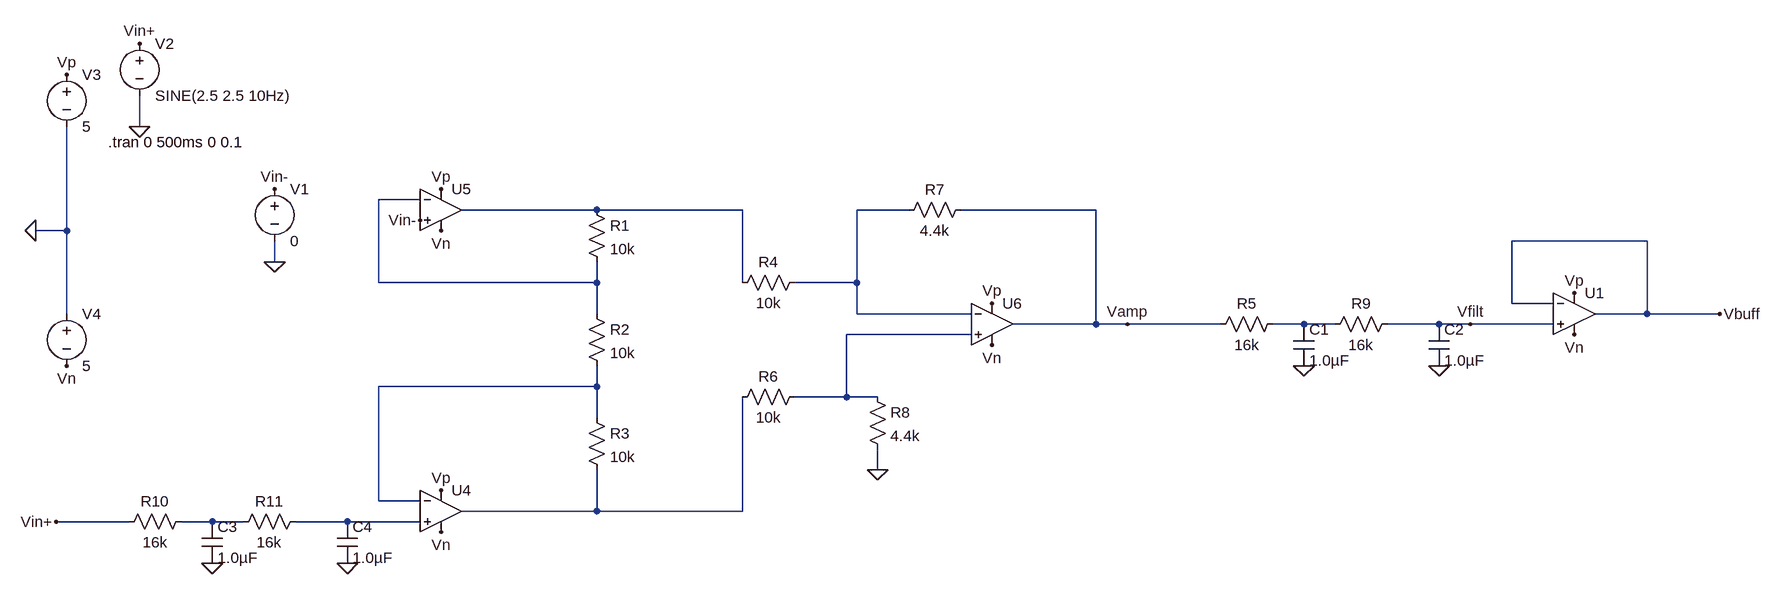
[diagram p0: schematic 3_OP_AMP_Gain_132(V2).asc]
3_OP_AMP_Gain_132(V2).asc, the LTspice schematic file:
Version 4
SHEET 1 2064 788
WIRE -448 -32 -448 -80
WIRE -16 80 -80 80
WIRE 256 96 48 96
WIRE 480 96 256 96
WIRE 736 96 656 96
WIRE 1024 96 816 96
WIRE -560 128 -560 -32
WIRE -560 128 -608 128
WIRE 1872 144 1664 144
WIRE -240 176 -240 144
WIRE -80 208 -80 80
WIRE 256 208 256 176
WIRE 256 208 -80 208
WIRE 480 208 480 96
WIRE 656 208 656 96
WIRE 656 208 560 208
WIRE 1664 240 1664 144
WIRE 1728 240 1664 240
WIRE -560 256 -560 128
WIRE 256 256 256 208
WIRE 656 256 656 208
WIRE 832 256 656 256
WIRE 1872 256 1872 144
WIRE 1872 256 1792 256
WIRE 1984 256 1872 256
WIRE 1024 272 1024 96
WIRE 1024 272 896 272
WIRE 1072 272 1024 272
WIRE 1216 272 1072 272
WIRE 1344 272 1296 272
WIRE 1392 272 1344 272
WIRE 1552 272 1472 272
WIRE 1600 272 1552 272
WIRE 1728 272 1600 272
WIRE 832 288 640 288
WIRE 256 368 256 336
WIRE 256 368 -80 368
WIRE 640 384 640 288
WIRE 640 384 560 384
WIRE 688 384 640 384
WIRE 256 416 256 368
WIRE 688 496 688 464
WIRE -80 544 -80 368
WIRE -16 544 -80 544
WIRE 256 560 256 496
WIRE 256 560 48 560
WIRE 480 560 480 384
WIRE 480 560 256 560
WIRE -464 576 -576 576
WIRE -336 576 -384 576
WIRE -288 576 -336 576
WIRE -128 576 -208 576
WIRE -16 576 -128 576
FLAG -240 176 0
FLAG -448 -32 0
FLAG 688 496 0
FLAG -608 128 0
FLAG -560 -112 Vp
FLAG 864 240 Vp
FLAG 16 64 Vp
FLAG 16 528 Vp
FLAG -560 336 Vn
FLAG 864 304 Vn
FLAG 16 592 Vn
FLAG 16 128 Vn
FLAG -240 64 Vin-
FLAG -16 112 Vin-
FLAG -448 -160 Vin+
FLAG -576 576 Vin+
FLAG 1072 272 Vamp
FLAG 1600 272 Vfilt
FLAG 1344 336 0
FLAG 1552 336 0
FLAG -336 640 0
FLAG -128 640 0
FLAG 1760 224 Vp
FLAG 1760 288 Vn
FLAG 1984 256 Vbuff
SYMBOL res 240 80 R0
SYMATTR InstName R1
SYMATTR Value 10k
SYMBOL res 240 240 R0
SYMATTR InstName R2
SYMATTR Value 10k
SYMBOL res 240 400 R0
SYMATTR InstName R3
SYMATTR Value 10k
SYMBOL res 576 192 R90
WINDOW 0 0 56 VBottom 2
WINDOW 3 32 56 VTop 2
SYMATTR InstName R4
SYMATTR Value 10k
SYMBOL res 576 368 R90
WINDOW 0 0 56 VBottom 2
WINDOW 3 32 56 VTop 2
SYMATTR InstName R6
SYMATTR Value 10k
SYMBOL res 832 80 R90
WINDOW 0 0 56 VBottom 2
WINDOW 3 32 56 VTop 2
SYMATTR InstName R7
SYMATTR Value 4.4k
SYMBOL res 672 368 R0
SYMATTR InstName R8
SYMATTR Value 4.4k
SYMBOL voltage -240 48 R0
WINDOW 123 0 0 Left 0
WINDOW 39 0 0 Left 0
SYMATTR InstName V1
SYMATTR Value 0
SYMBOL voltage -448 -176 R0
WINDOW 123 0 0 Left 0
WINDOW 39 0 0 Left 0
SYMATTR InstName V2
SYMATTR Value SINE(2.5 2.5 10Hz)
SYMBOL voltage -560 -128 R0
SYMATTR InstName V3
SYMATTR Value 5
SYMBOL voltage -560 240 R0
SYMATTR InstName V4
SYMATTR Value 5
SYMBOL res 1312 256 R90
WINDOW 0 0 56 VBottom 2
WINDOW 3 32 56 VTop 2
SYMATTR InstName R5
SYMATTR Value 16k
SYMBOL res 1488 256 R90
WINDOW 0 0 56 VBottom 2
WINDOW 3 32 56 VTop 2
SYMATTR InstName R9
SYMATTR Value 16k
SYMBOL cap 1328 272 R0
SYMATTR InstName C1
SYMATTR Value 1.0µF
SYMBOL cap 1536 272 R0
SYMATTR InstName C2
SYMATTR Value 1.0µF
SYMBOL OpAmps\\UniversalOpAmp2 16 560 R0
SYMATTR InstName U4
SYMBOL OpAmps\\UniversalOpAmp2 16 96 R0
SYMATTR InstName U5
SYMBOL OpAmps\\UniversalOpAmp2 864 272 R0
SYMATTR InstName U6
SYMBOL res -368 560 R90
WINDOW 0 0 56 VBottom 2
WINDOW 3 32 56 VTop 2
SYMATTR InstName R10
SYMATTR Value 16k
SYMBOL res -192 560 R90
WINDOW 0 0 56 VBottom 2
WINDOW 3 32 56 VTop 2
SYMATTR InstName R11
SYMATTR Value 16k
SYMBOL cap -352 576 R0
SYMATTR InstName C3
SYMATTR Value 1.0µF
SYMBOL cap -144 576 R0
SYMATTR InstName C4
SYMATTR Value 1.0µF
SYMBOL OpAmps\\UniversalOpAmp2 1760 256 R0
SYMATTR InstName U1
TEXT -496 -8 Left 2 !.tran 0 500ms 0 0.1

The netlist it stands for:
* 3_OP_AMP_Gain_132(V2).asc
R1 N002 N001 10k
R2 N001 N006 10k
R3 N006 N007 10k
R4 N003 N002 10k
R6 N005 N007 10k
R7 Vamp N003 4.4k
R8 N005 0 4.4k
V1 Vin- 0 0
V2 Vin+ 0 SINE(2.5 2.5 10Hz)
V3 Vp 0 5
V4 0 Vn 5
R5 N004 Vamp 16k
R9 Vfilt N004 16k
C1 N004 0 1.0µF
C2 Vfilt 0 1.0µF
XU4 N009 N006 Vp Vn N007 level2 Avol=1Meg GBW=10Meg Slew=10Meg Ilimit=25m Rail=0 Vos=0 En=0 Enk=0 In=0 Ink=0 Rin=500Meg  ; pins In+ In- V+ V- OUT
XU5 Vin- N001 Vp Vn N002 level2 Avol=1Meg GBW=10Meg Slew=10Meg Ilimit=25m Rail=0 Vos=0 En=0 Enk=0 In=0 Ink=0 Rin=500Meg  ; pins In+ In- V+ V- OUT
XU6 N005 N003 Vp Vn Vamp level2 Avol=1Meg GBW=10Meg Slew=10Meg Ilimit=25m Rail=0 Vos=0 En=0 Enk=0 In=0 Ink=0 Rin=500Meg  ; pins In+ In- V+ V- OUT
R10 N008 Vin+ 16k
R11 N009 N008 16k
C3 N008 0 1.0µF
C4 N009 0 1.0µF
XU1 Vfilt Vbuff Vp Vn Vbuff level2 Avol=1Meg GBW=10Meg Slew=10Meg Ilimit=25m Rail=0 Vos=0 En=0 Enk=0 In=0 Ink=0 Rin=500Meg  ; pins In+ In- V+ V- OUT
.tran 0 500ms 0 0.1
.lib UniversalOpAmp2.lib
.backanno
.end